# EAGLE design Hardware Schematic (EAGLE 9.6.2)
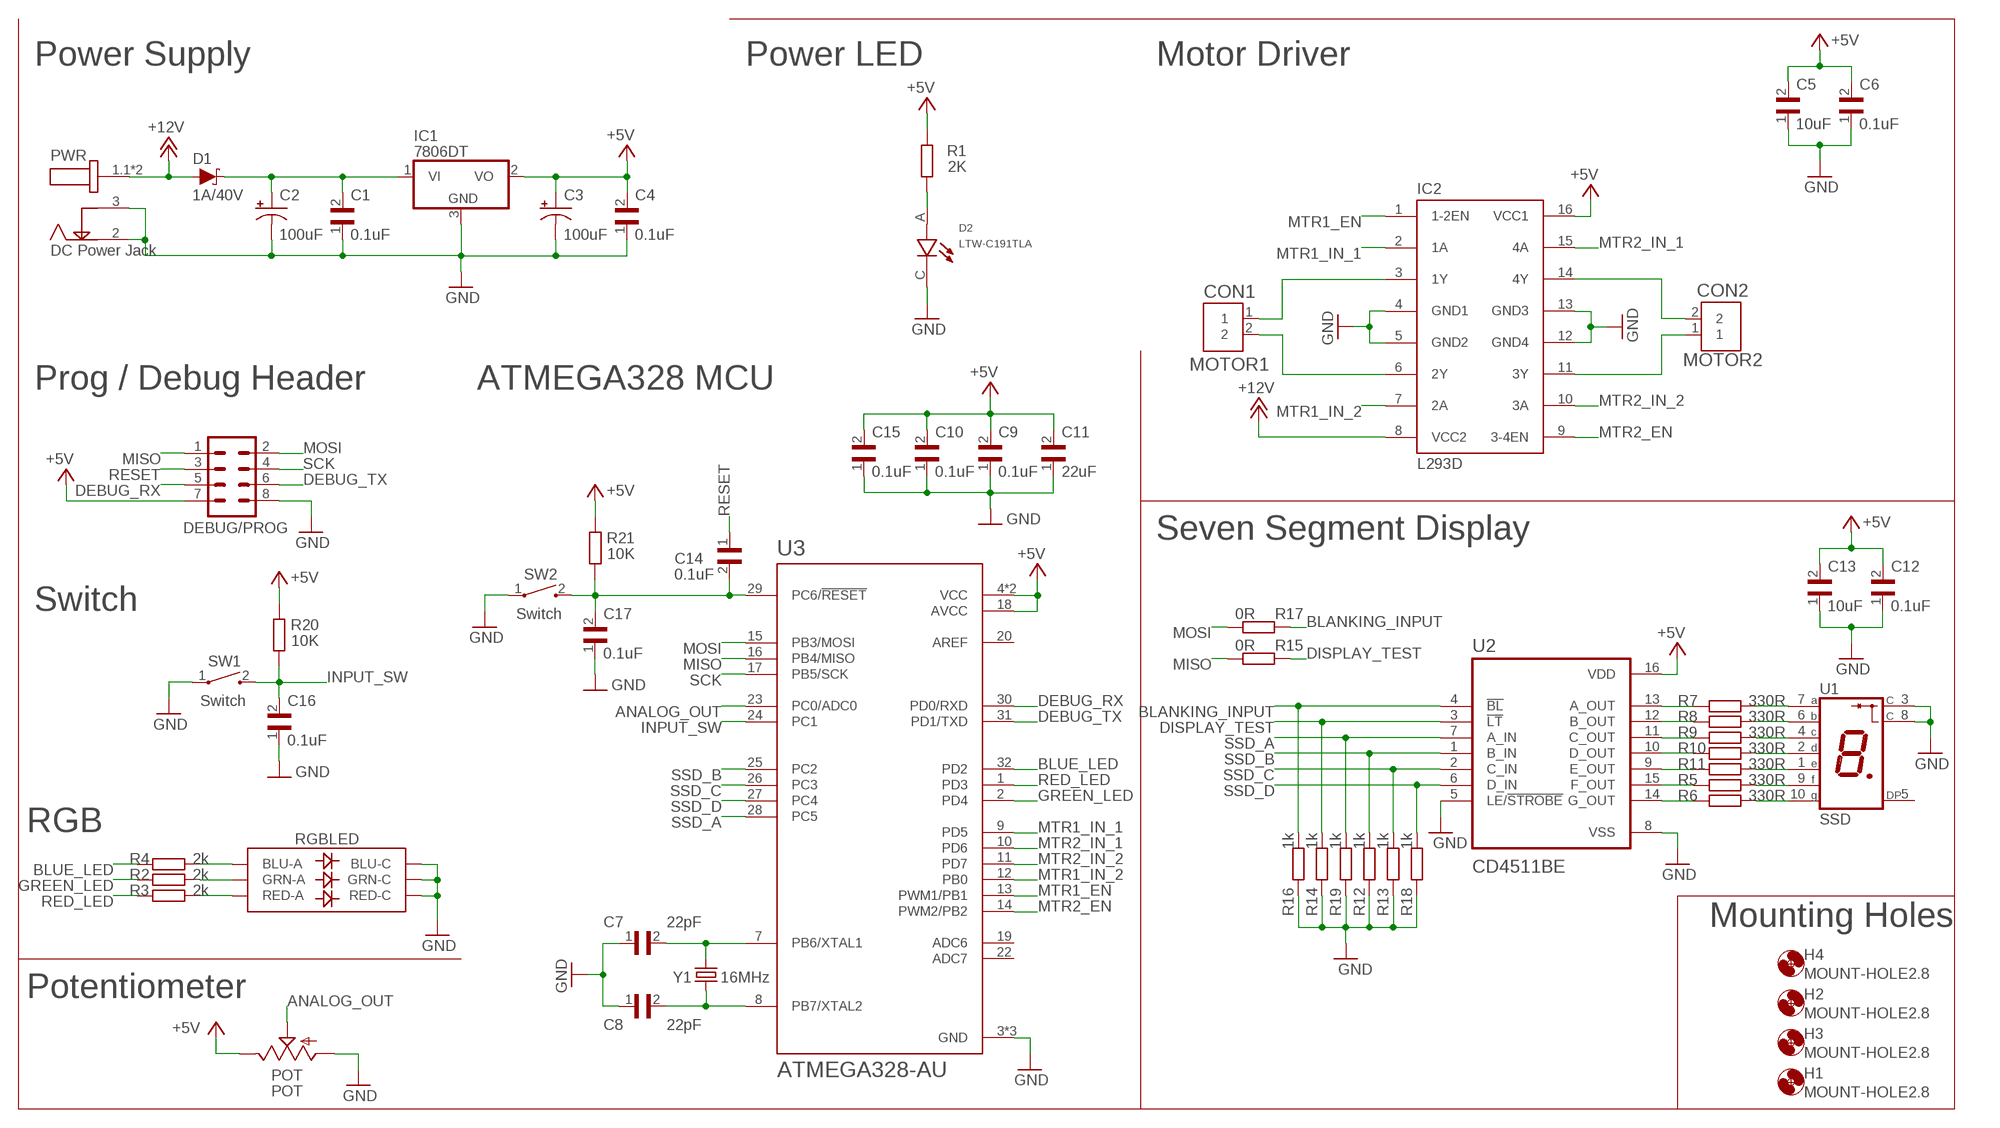
[diagram p0: schematic, sheet 1]

## Parts
C1  0.1uF  CAPACITOR  [C0603]
C2  100uF  100UF-POLAR-RADIAL-2.5MM-25V-20%  [CPOL-RADIAL-2.5MM-6.5MM]
C3  100uF  100UF-POLAR-RADIAL-2.5MM-25V-20%  [CPOL-RADIAL-2.5MM-6.5MM]
C4  0.1uF  CAPACITOR  [C0603]
C5  10uF  CAPACITOR  [C0603]
C6  0.1uF  CAPACITOR  [C0603]
C7  22pF  CAPACITOR  [C0603]
C8  22pF  CAPACITOR  [C0603]
C9  0.1uF  CAPACITOR  [C0603]
C10  0.1uF  CAPACITOR  [C0603]
C11  22uF  CAPACITOR  [C0603]
C12  0.1uF  CAPACITOR  [C0603]
C13  10uF  CAPACITOR  [C0603]
C14  0.1uF  CAPACITOR  [C0603]
C15  0.1uF  CAPACITOR  [C0603]
C16  0.1uF  CAPACITOR  [C0603]
C17  0.1uF  CAPACITOR  [C0603]
CON1  MOTOR1  282836-2  [CONN_282836-2]
CON2  MOTOR2  282836-2  [CONN_282836-2]
D1  1A/40V  DIODE-SCHOTTKY-SS14  [SMA-DIODE]
D2  LTW-C191TLA  [LEDC1608X65N]
DEBUG/PROG  MA04-2  [MA04-2]
H1  MOUNT-HOLE2.8  [2,8]
H2  MOUNT-HOLE2.8  [2,8]
H3  MOUNT-HOLE2.8  [2,8]
H4  MOUNT-HOLE2.8  [2,8]
IC1  7806DT  [TO252]
IC2  L293D  [DIL16]
POT  POT  TRIM_US-S64W  [S64W]
PWR  DC Power Jack  DCJ200-05-A-XX-X_REVA  [GCT_DCJ200-05-A-XX-X_REVA]
R1  2K  RESISTOR  [R0603]
R2  2k  RESISTOR  [R0603]
R3  2k  RESISTOR  [R0603]
R4  2k  RESISTOR  [R0603]
R5  330R  RESISTOR  [R0603]
R6  330R  RESISTOR  [R0603]
R7  330R  RESISTOR  [R0603]
R8  330R  RESISTOR  [R0603]
R9  330R  RESISTOR  [R0603]
R10  330R  RESISTOR  [R0603]
R11  330R  RESISTOR  [R0603]
R12  1k  RESISTOR  [R0603]
R13  1k  RESISTOR  [R0603]
R14  1k  RESISTOR  [R0603]
R15  0R  RESISTOR  [R0603]
R16  1k  RESISTOR  [R0603]
R17  0R  RESISTOR  [R0603]
R18  1k  RESISTOR  [R0603]
R19  1k  RESISTOR  [R0603]
R20  10K  RESISTOR  [R0603]
R21  10K  RESISTOR  [R0603]
RGBLED  LED-RGBNO_IC  [LED-TRICOLOR-5050]
SW1  Switch  1437566-3  [SW_1437566-3]
SW2  Switch  1437566-3  [SW_1437566-3]
U1  SSD  SC52-11HWA  [LED_SC52-11HWA]
U2  CD4511BE  [DIP794W45P254L1969H508Q16]
U3  ATMEGA328-AU  [QFP80P900X900X120-32N]
Y1  16MHz  CRYSTAL-16MHZPTH-HC49US  [HC49US]

## Nets
+5V: C3.1(+) C4.2 C5.2 C6.2 C9.2 C10.2 C11.2 C12.2 C13.2 C15.2 DEBUG/PROG.7 IC1.2(VO) IC2.16(VCC1) POT.E R1.2 R20.2 R21.2 U2.16(VDD) U3.4(VCC) U3.6(VCC) U3.18(AVCC)
+12V: D1.A IC2.8(VCC2) PWR.1.1 PWR.1.2
ANALOG_OUT: POT.S U3.23(PC0/ADC0)
BLANKING_INPUT: R16.2 R17.1 U2.4(!BL)
BLUE_LED: R4.1 U3.32(PD2)
DEBUG_RX: DEBUG/PROG.5 U3.30(PD0/RXD)
DEBUG_TX: DEBUG/PROG.6 U3.31(PD1/TXD)
DISPLAY_TEST: R14.2 R15.1 U2.3(!LT)
GND: C1.1 C2.2(-) C3.2(-) C4.1 C5.1 C6.1 C7.1 C8.1 C9.1 C10.1 C11.1 C12.1 C13.1 C15.1 C16.1 C17.1 D2.C DEBUG/PROG.8 IC1.3(GND) IC2.4(GND1) IC2.5(GND2) IC2.12(GND4) IC2.13(GND3) POT.A PWR.2 PWR.3 R12.1 R13.1 R14.1 R16.1 R18.1 R19.1 RGBLED.4(BLU-C) RGBLED.5(RED-C) RGBLED.6(GRN-C) SW1.1 SW2.1 U1.3(C) U1.8(C) U2.5(LE/!STROBE) U2.8(VSS) U3.3(GND) U3.5(GND) U3.21(GND)
GREEN_LED: R2.1 U3.2(PD4)
INPUT_SW: C16.2 R20.1 SW1.2 U3.24(PC1)
MISO: DEBUG/PROG.1 R15.2 U3.16(PB4/MISO)
MOSI: DEBUG/PROG.2 R17.2 U3.15(PB3/MOSI)
MTR1_EN: IC2.1(1-2EN) U3.13(PWM1/PB1)
MTR1_IN_1: IC2.2(1A) U3.9(PD5)
MTR1_IN_2: IC2.7(2A) U3.12(PB0)
MTR2_EN: IC2.9(3-4EN) U3.14(PWM2/PB2)
MTR2_IN_1: IC2.15(4A) U3.10(PD6)
MTR2_IN_2: IC2.10(3A) U3.11(PD7)
N$1: R3.2 RGBLED.2(RED-A)
N$2: R2.2 RGBLED.1(GRN-A)
N$3: R4.2 RGBLED.3(BLU-A)
N$4: R7.1 U2.13(A_OUT)
N$5: R8.1 U2.12(B_OUT)
N$6: R9.1 U2.11(C_OUT)
N$7: R10.1 U2.10(D_OUT)
N$8: R11.1 U2.9(E_OUT)
N$9: R5.1 U2.15(F_OUT)
N$10: R6.1 U2.14(G_OUT)
N$11: R7.2 U1.7(A)
N$12: R8.2 U1.6(B)
N$13: R9.2 U1.4(C)
N$14: R10.2 U1.2(D)
N$15: R11.2 U1.1(E)
N$16: R5.2 U1.9(F)
N$17: R6.2 U1.10(G)
N$18: CON2.1 IC2.11(3Y)
N$19: D2.A R1.1
N$20: C1.2 C2.1(+) D1.C IC1.1(VI)
N$21: C8.2 U3.8(PB7/XTAL2) Y1.1
N$22: C7.2 U3.7(PB6/XTAL1) Y1.2
N$24: C14.2 C17.2 R21.1 SW2.2 U3.29(PC6/!RESET)
N$34: CON1.1 IC2.3(1Y)
N$35: CON1.2 IC2.6(2Y)
N$36: CON2.2 IC2.14(4Y)
RED_LED: R3.1 U3.1(PD3)
RESET: C14.1 DEBUG/PROG.3
SCK: DEBUG/PROG.4 U3.17(PB5/SCK)
SSD_A: R19.2 U2.7(A_IN) U3.28(PC5)
SSD_B: R12.2 U2.1(B_IN) U3.25(PC2)
SSD_C: R13.2 U2.2(C_IN) U3.26(PC3)
SSD_D: R18.2 U2.6(D_IN) U3.27(PC4)
Unconnected: U1.5(DP) U3.19(ADC6) U3.20(AREF) U3.22(ADC7)

## Notes on the sheet
- Power Supply | Power LED | Motor Driver
- Prog / Debug Header | ATMEGA328 MCU
- Seven Segment Display
- Switch
- RGB
- Mounting Holes
- Potentiometer

## Library data of the parts
C1 C4-C17 = PC_Capacitor_0603:CAPACITOR: CAP CERAMIC, 0.1UF, 50V, X7R, 0603, FULL REEL Check prices <https://pricing.snapeda.com/parts/CGA3E2X7R1H104K080AA/TDK/view-part?ref=eda>; AVAILABILITY: Good; DESCRIPTION: 0.1µF ±10% 50V Ceramic Capacitor X7R 0603 (1608 Metric); MF: TDK; MP: CGA3E2X7R1H104K080AA; PACKAGE: 1608 TDK; PRICE: None; PURCHASE-URL: https://pricing.snapeda.com/search/part/CGA3E2X7R1H104K080AA/?ref=eda
C2 C3 = SparkFun-Capacitors:100UF-POLAR: 100µF polarized capacitors A capacitor is a passive two-terminal electrical component used to store electrical energy temporarily in an electric field.; PROD_ID: CAP-08439
CON1 CON2 = PC_Con_ScrewTerminal_2P_5mm:282836-2: TERM BLOCK 2POS SIDE ENTRY 5MM Check availability <https://pricing.snapeda.com/parts/282836-2/TE%20Connectivity/view-part?ref=eda>; AVAILABILITY: In Stock; COMMENT: 282836-2; DESCRIPTION: Connector, Terminal Block; Wire Receptacle; 2 Pos.; 16-30 AWG; 0.197 in. CL; Sid; MF: TE Connectivity; MP: 282836-2; PACKAGE: None; PRICE: None; PURCHASE-URL: https://pricing.snapeda.com/search/part/282836-2/?ref=eda
D1 = SparkFun-DiscreteSemi:DIODE-SCHOTTKY: Schottky diode A Schottky diode is a semiconductor diode which has a low forward voltage drop and a very fast switching action.; PROD_ID: DIO-08053; VALUE: 1A/40V/500mV
D2 = PC_LED_0603:LTW-C191TLA: CHIP LED WHITE 0603 TOP VIEW Check prices <https://pricing.snapeda.com/parts/LTW-C191TLA/Lite-On/view-part?ref=eda>; AVAILABILITY: Warning; DESCRIPTION: White LED Indication - Discrete 3.1V 0603 (1608 Metric); MF: Lite-On; MP: LTW-C191TLA; PACKAGE: 0603 Lite-On; PRICE: None; PURCHASE-URL: https://pricing.snapeda.com/search/part/LTW-C191TLA/?ref=eda
DEBUG/PROG = con-lstb:MA04-2: PIN HEADER; OC_FARNELL: unknown; OC_NEWARK: unknown
H1-H4 = holes:MOUNT-HOLE: MOUNTING HOLE with drill center marker
IC1 = linear:78*: Positive VOLTAGE REGULATOR Source: http://cache.national.com/ds/LM/LM78L05.pdf http://www.fairchildsemi.com/ds/LM/LM7805.pdf
IC2 = st-microelectronics:L293D: PUSH-PULL 4 CHANNEL DRIVER; MPN: L293D; OC_FARNELL: 9589619; OC_NEWARK: 56P8249
POT = pot:TRIM_US-: POTENTIOMETER
PWR = PC_CON_DC_Power_Jack:DCJ200-05-A-XX-X_REVA: DC Power Jack, SMT, Horizontal, with Locating Pegs, D2.0mm Check prices <https://pricing.snapeda.com/parts/DCJ200-05-A-K1-A/Global%20Connector%20Technology/view-part?ref=eda>; AVAILABILITY: Warning; DESCRIPTION: Power Barrel Connector Jack 2.05mm ID (0.081), 5.50mm OD (0.217) Surface Mount, Right Angle; MF: Global Connector Technology; MP: DCJ200-05-A-K1-A; PACKAGE: None; PRICE: None; PURCHASE-URL: https://pricing.snapeda.com/search/part/DCJ200-05-A-K1-A/?ref=eda
R1-R21 = PC_Resistor_0603:RESISTOR; MF: Yageo; RESISTOR: 0603
RGBLED = SparkFun-LED:LED-RGB: LED-RGB 6 pin RGB LED (no common connector) Packages: PLCC-6 LED-TRICOLOR-5050 - No built-in IC SparkFun Products: Digital Sandbox <https://www.sparkfun.com/products/12651> LED- SMD RGB <https://www.sparkfun.com/products/10866>; PROD_ID: DIO-10298
SW1 SW2 = PC_Switch_1437566-3:1437566-3: Switch Tactile OFF (ON) SPST Rectangular Button Gull Wing 0.05A 12VDC SMD Loose Piece Check prices <https://pricing.snapeda.com/parts/1437566-3/TE%20Connectivity/view-part?ref=eda>; AVAILABILITY: Good; COMMENT: 1437566-3; CONFIGURATION_POLE-THROW: Single Pole - Single Throw; CONTACT_CURRENT_RATING: 50 mA; DESCRIPTION: Tactile Switch SPST-NO Top Actuated Surface Mount; MF: TE Connectivity; MP: 1437566-3; PACKAGE: None; PRICE: None
U1 = PC_LED-7-SegmentDisplay:SC52-11HWA: Display: LED; single 7-segment; 13.2mm; red; 0.9-2.2mcd Check availability <https://pricing.snapeda.com/parts/SC52-11HWA/Kingbright/view-part?ref=eda>; AVAILABILITY: Not in stock; DESCRIPTION: Display: LED; single 7-segment; 13.2mm; red; 0.9-2.2mcd; MF: Kingbright; MP: SC52-11HWA; PACKAGE: None; PRICE: None
U2 = PC_IC_CD4511BE:CD4511BE: None Check availability <https://pricing.snapeda.com/parts/CD4511BE/Texas%20Instruments/view-part?ref=eda>; AVAILABILITY: In Stock; DESCRIPTION: CMOS BCD-to-7-Segment LED Latch Decoder Drivers 16-PDIP -55 to 125; MF: Texas Instruments; MP: CD4511BE; PACKAGE: PDIP-16 Texas Instruments; PRICE: None; PURCHASE-URL: https://pricing.snapeda.com/search/part/CD4511BE/?ref=eda
U3 = PC_IC_ATMEGA328-AU:ATMEGA328-AU: ATmega Series 20 MHz 32 KB Flash 2 KB SRAM 8-Bit Microcontroller - TQFP-32 Check prices <https://pricing.snapeda.com/parts/ATMEGA328-AU/Microchip/view-part?ref=eda>; AVAILABILITY: In Stock; DESCRIPTION: AVR AVR® ATmega Microcontroller IC 8-Bit 20MHz 32KB (16K x 16) FLASH 32-TQFP (7x7); MF: Microchip; MP: ATMEGA328-AU; PACKAGE: TQFP-32 Microchip; PRICE: None; PURCHASE-URL: https://pricing.snapeda.com/search/part/ATMEGA328-AU/?ref=eda
Y1 = SparkFun-Clocks:CRYSTAL-16MHZ: 16MHz Crystal Digikey Example <http://www.digikey.com/product-search/en?keywords=535-9122-1-ND> Frequency: 16MHz Frequency Stability: ±50ppm Frequency Tolerance: ±20ppm Load Capacitance: 18pF SparkFun Products: Pro Micro -5V/16MHz <https://www.sparkfun.com/products/12640> SparkFun Serial Enabled LCD Kit <https://www.sparkfun.com/products/10097>; PROD_ID: XTAL-08181; SF_ID: COM-00536

## Board
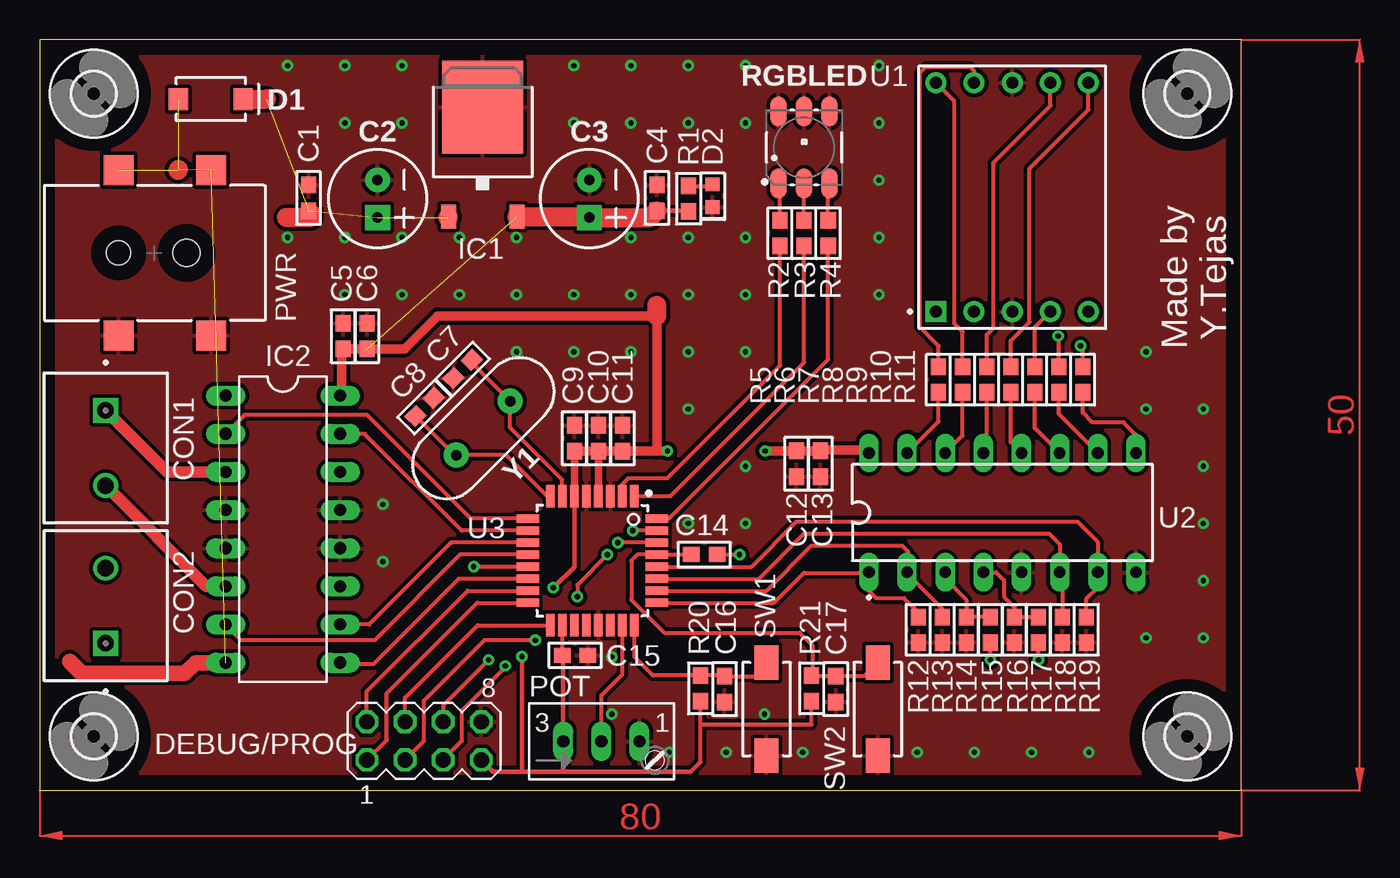
[diagram p1: board, top side]
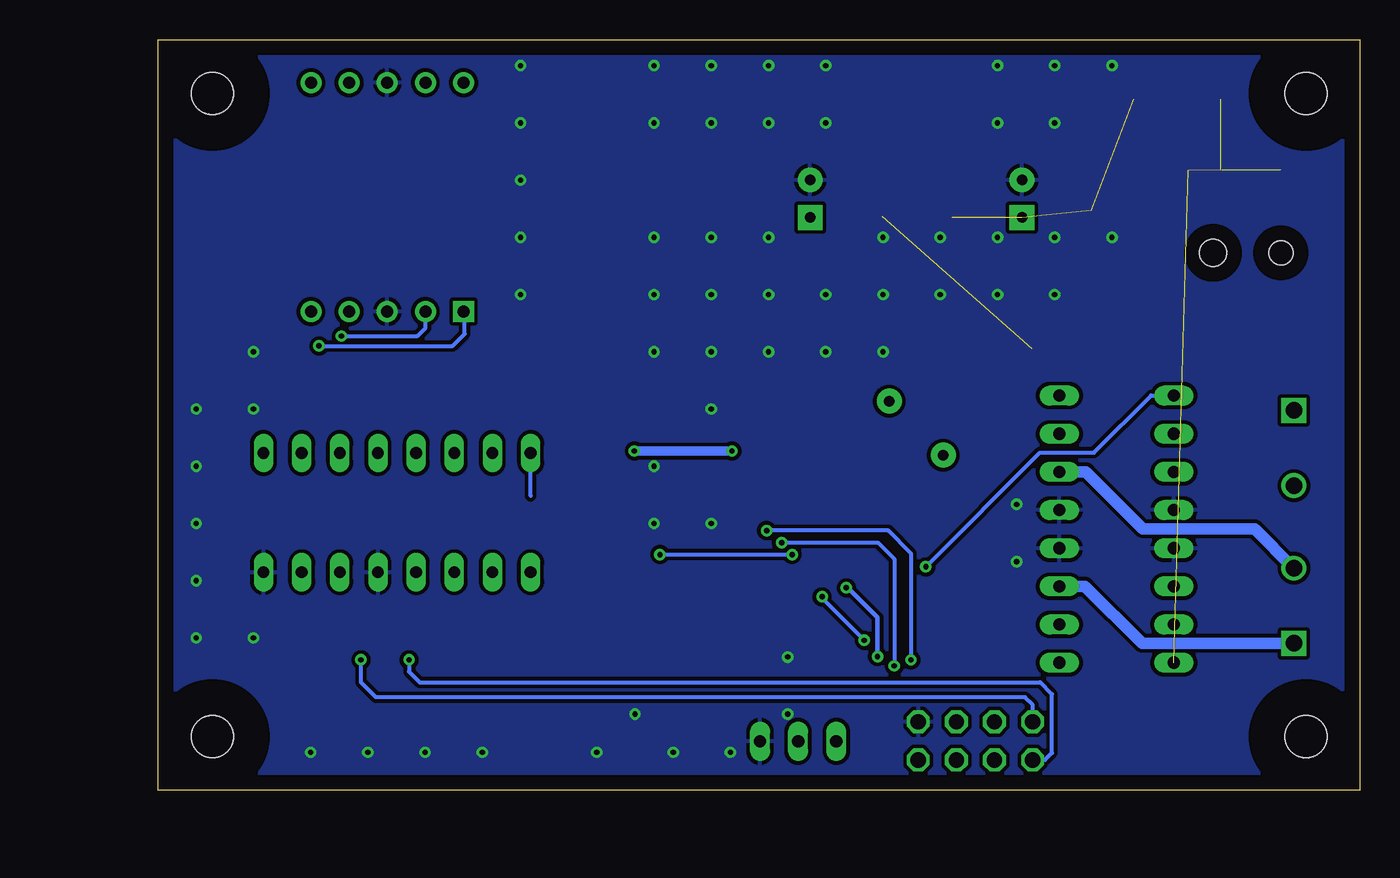
[diagram p2: board, bottom side, seen from below]

Size 80 x 50 mm. Coordinates in mm from the lower left corner, seen from the top.
Outline: 0,0 80,0 80,50 0,50 0,0
Copper layers (1*16): Top 0.035mm / dielectric 1.5mm / Bottom 0.035mm
Design rules "default *": minimum track width 6mil, minimum drill 0.35mm, track to track 6mil, track to pad 6mil, pad to pad 6mil, via to via 6mil, smd to smd 6mil, copper to edge 40mil, drill to drill 6mil, minimum pad ring 10mil, minimum via ring 8mil, stop-mask expansion 4mil, vias tented up to drill 20mil, thermal gap 10mil

### Footprints (pad centres in the part's own frame; a part is rotated, then mirrored left to right if it is on the bottom)
C0603 = smd 1.1 x 1: 1 -0.909,0; 2 0.809,0
CPOL-RADIAL-2.5MM-6.5MM = drill 0.7 pad 1.651 square: 1 1.25,0 | drill 0.7 pad 1.651: 2 -1.25,0
CONN_282836-2 = drill 1.1 square: 1 -2.5,0 | drill 1.1: 2 2.5,0
SMA-DIODE = smd 1.27 x 1.47: A -2.15,0; C 2.15,0
LEDC1608X65N = smd 0.91 x 0.93: A 0.76,0; C -0.76,0
MA04-2 = drill 1.016 octagon: 1 -3.81,-1.27; 2 -3.81,1.27; 3 -1.27,-1.27; 4 -1.27,1.27; 5 1.27,-1.27; 6 1.27,1.27; 7 3.81,-1.27; 8 3.81,1.27
2,8 = hole 2.8: 0,0
TO252 = smd 1 x 1.6: 1 -2.28,-4.8; 2 2.28,-4.8 | smd 5.4 x 6.2: 3 0,2.5
DIL16 = drill 0.813 long: 1 -8.89,-3.81; 2 -6.35,-3.81; 3 -3.81,-3.81; 4 -1.27,-3.81; 5 1.27,-3.81; 6 3.81,-3.81; 7 6.35,-3.81; 8 8.89,-3.81; 9 8.89,3.81; 10 6.35,3.81; 11 3.81,3.81; 12 1.27,3.81; 13 -1.27,3.81; 14 -3.81,3.81; 15 -6.35,3.81; 16 -8.89,3.81
S64W = drill 0.813 long: A 2.54,1.27; E -2.54,1.27; S 0,1.27
GCT_DCJ200-05-A-XX-X_REVA = smd 2 x 2: 1.1 -5.5,3.8; 1.2 -5.5,-2.35; 2 5.5,-2.35; 3 5.5,3.8 | hole 1.8: 0,2.15 | hole 1.6: 0,-2.35
R0603 = smd 1.1 x 1: 1 -0.85,0; 2 0.85,0
LED-TRICOLOR-5050 = smd 2 x 1.1: 1 -2.4,1.7; 2 -2.4,0; 3 -2.4,-1.7; 4 2.4,-1.7; 5 2.4,0; 6 2.4,1.7
SW_1437566-3 = smd 2.3 x 1.6: 1 -3.08,0; 2 3.12,0
LED_SC52-11HWA = drill 0.8 pad 1.4 square: 1 -7.62,5.08 | drill 0.8 pad 1.4: 2 -7.62,2.54; 3 -7.62,0; 4 -7.62,-2.54; 5 -7.62,-5.08; 6 7.62,-5.08; 7 7.62,-2.54; 8 7.62,0; 9 7.62,2.54; 10 7.62,5.08
DIP794W45P254L1969H508Q16 = drill 0.78 pad 1.13 long: 1 -3.97,8.89; 2 -3.97,6.35; 3 -3.97,3.81; 4 -3.97,1.27; 5 -3.97,-1.27; 6 -3.97,-3.81; 7 -3.97,-6.35; 8 -3.97,-8.89; 9 3.97,-8.89; 10 3.97,-6.35; 11 3.97,-3.81; 12 3.97,-1.27; 13 3.97,1.27; 14 3.97,3.81; 15 3.97,6.35; 16 3.97,8.89
QFP80P900X900X120-32N = smd 1.5 x 0.55: 1 -4.3,2.8; 2 -4.3,2; 3 -4.3,1.2; 4 -4.3,0.4; 5 -4.3,-0.4; 6 -4.3,-1.2; 7 -4.3,-2; 8 -4.3,-2.8; 17 4.3,-2.8; 18 4.3,-2; 19 4.3,-1.2; 20 4.3,-0.4; 21 4.3,0.4; 22 4.3,1.2; 23 4.3,2; 24 4.3,2.8 | smd 0.55 x 1.5: 9 -2.8,-4.3; 10 -2,-4.3; 11 -1.2,-4.3; 12 -0.4,-4.3; 13 0.4,-4.3; 14 1.2,-4.3; 15 2,-4.3; 16 2.8,-4.3; 25 2.8,4.3; 26 2,4.3; 27 1.2,4.3; 28 0.4,4.3; 29 -0.4,4.3; 30 -1.2,4.3; 31 -2,4.3; 32 -2.8,4.3
HC49US = drill 0.7 pad 1.651: 1 -2.54,0; 2 2.54,0

### Placement (x,y rotation side)
C1  17.9,39.4 270 top
C2  22.5,39.4 270 top
C3  36.6,39.4 270 top
C4  41.1,39.4 270 top
C5  20.2,30.2 270 top
C6  21.8,30.2 270 top
C7  28.2,28.1 45 top
C8  25.6,25.5 225 top
C9  35.6,23.4 270 top
C10  37.2,23.4 270 top
C11  38.8,23.4 270 top
C12  50.4,21.8 90 top
C13  52,21.8 90 top
C14  44.2,15.7 180 top
C15  35.6,9 180 top
C16  45.6,6.8 90 top
C17  53,6.8 90 top
CON1  4.4,22.8 270 top
CON2  4.4,12.3 90 top
D1  11.4,46.03 0 top
D2  44.8,39.6 90 top
DEBUG/PROG  25.6,3.3 0 top
H1  3.6,46.4 0 top
H2  76.4,46.4 0 top
H3  3.6,3.6 0 top
H4  76.4,3.6 0 top
IC1  29.5,43 0 top
IC2  16.2,17.4 270 top
POT  37.4,2 0 top
PWR  7.62,35.79 270 top
R1  43.2,39.4 270 top
R2  49.3,37.1 90 top
R3  50.9,37.1 90 top
R4  52.5,37.1 90 top
R5  59.85,27.35 90 top
R6  61.45,27.35 90 top
R7  63.05,27.35 90 top
R8  64.65,27.35 90 top
R9  66.25,27.35 90 top
R10  67.85,27.35 90 top
R11  69.45,27.35 90 top
R12  58.5,10.7 90 top
R13  60.1,10.7 90 top
R14  61.7,10.7 90 top
R15  63.3,10.7 270 top
R16  64.9,10.7 90 top
R17  66.5,10.7 270 top
R18  68.1,10.7 90 top
R19  69.7,10.7 90 top
R20  44,6.8 270 top
R21  51.4,6.8 270 top
RGBLED  50.9,42.81 90 top
SW1  48.4,5.4 90 top
SW2  55.8,5.4 90 top
U1  64.75,39.5 90 top
U2  64.1,18.5 90 top
U3  36.8,15.3 270 top
Y1  29.53,24.13 45 top

### Tracks (layer width: path | path; a pad name or v marks a point on that pad's centre or on a via)
+5V  (via drill 0.35)  (1 unrouted)
  Top 0.254: 37.2,22.5 C10.2 | C13.2 52.06,22.67 | U2.16 55.01,22.67 | 20.11,29.3 C5.2 | U3.18 C15.2 | 43.34,1.24 44,1.9 44,4.4 | 44,4.4 R20.2 | 44,4.4 51.4,4.4 R21.2 | 32.12,1.26 32.1,1.24
  Top 0.305: U3.6 35.6,14.9 v34.2,13.5 | 43.34,1.24 34.86,1.24 | 34.86,1.24 34.86,1.25 POT.E 34.86,8.93 C15.2 | 34.86,1.24 32.1,1.24 30.2,1.24 DEBUG/PROG.7 | C4.2 43.16,38.59 R1.2 | v32.12,8.92 32.12,1.26
  Top 0.508: C9.2 U3.6 | U3.4 37.2,22.5
  Top 0.635: 55.01,22.67 52.06,22.67 | C13.2 C12.2 v48.31,22.61 v48.3,22.6 | 20.11,29.3 20.11,26.39 IC2.16 | C5.2 C6.2 24.29,29.39 26.5,31.6 41.1,31.6 | 41.1,32.3 41.1,22.6 41.09,22.59 | 41.09,22.59 C11.2 37.29,22.59 | 37.29,22.59 37.2,22.5 | C9.2 37.29,22.59 | v41.8,22.6 v41.79,22.59 41.09,22.59
  Top 1.27: IC1.2 36.55,38.2 C3.1 40.66,38.15 C4.2 | 41.1,31.6 41.1,32.3
  Bottom 0.254: 55.21,19.61 U2.16
  Bottom 0.305: v34.2,13.5 34.1,13.5 32.12,11.52 v32.12,8.92
  Bottom 0.635: v48.3,22.6 v41.8,22.6
+12V  (4 unrouted)
  Top 1.016: 2,8.6 2.8,7.8 9.68,7.8 10.39,8.51 IC2.8
  Top 1.27: 9.25,41.34 9.2,41.29
ANALOG_OUT
  Top 0.254: POT.S 37.4,6.33 38.8,7.73 U3.23
BLANKING_INPUT
  Top 0.254: U2.4 63.67,14.53 64.2,14 64.2,12.9 64.9,12.2 R16.2 R17.1
BLUE_LED
  Top 0.254: U3.32 41.9,18.1 52.5,28.7 R4.1
DEBUG_RX  (via drill 0.35)
  Top 0.254: U3.30 v38.5,16.5 | DEBUG/PROG.5 26.87,2.07 28.1,3.3 28.1,5.3 31,8.2 v31,8.3
  Bottom 0.254: v38.5,16.5 32.1,16.5 31,15.4 v31,8.3
DEBUG_TX  (via drill 0.35)
  Top 0.254: U3.31 v39.5,17.3 | v29.89,8.69 26.87,5.67 DEBUG/PROG.6
  Bottom 0.254: v39.5,17.3 31.4,17.3 29.89,15.79 v29.89,8.69
DISPLAY_TEST
  Top 0.254: U2.3 60.29,14.11 61.7,12.7 R14.2 R15.1
GND  (via drill 0.35)
  other vias: 77.47,25.4 73.66,25.4 77.47,21.59 77.47,17.78 77.47,13.97 77.47,10.16 55.88,40.64 55.88,36.83 55.88,33.02 46.99,33.02 46.99,29.21 39.37,33.02 35.56,33.02 31.75,33.02 27.94,33.02 24.13,33.02 46.99,48.26 46.99,44.45 43.18,48.26 43.18,44.45 39.37,48.26 39.37,44.45 35.56,48.26 35.56,44.45 24.13,48.26 20.32,48.26 16.51,48.26 20.32,44.45 24.13,44.45 43.18,33.02 43.18,29.21 43.18,25.4 43.18,17.78 46.99,17.78 22.86,19.05 22.86,15.24 39.37,29.21 35.56,29.21 31.75,29.21 55.88,44.45 46.99,36.83 43.18,36.83 20.32,33.02 20.32,36.83 16.51,36.83 27.94,36.83 31.75,36.83 39.37,36.83 55.88,48.26 24.13,36.83 46.99,21.59 73.66,10.16 69.85,2.54 66.04,2.54 62.23,2.54 58.42,2.54 50.8,2.54 45.72,2.54 48.26,5.08 73.66,29.21 41.91,2.54 38.1,5.08 38.1,8.89
  pour Top (isolate 0.254): -1.27,52.07 6.35,52.07 82.55,52.07 82.55,45.72 82.55,-2.54 67.31,-2.54 -2.54,-2.54 -2.54,52.07
  pour Bottom (isolate 0.254): -2.54,52.07 0,52.07 82.55,52.07 82.55,45.72 82.55,-2.54 76.2,-2.54 -2.54,-2.54
GREEN_LED
  Top 0.254: U3.2 38.8,20.4 39.2,20.8 41.8,20.8 49.3,28.3 R2.1
INPUT_SW
  Top 0.254: U3.24 39.6,8.9 40.85,7.65 R20.1 45.56,7.65 C16.2 48.4,7.61 SW1.2
MISO  (via drill 0.35)
  Top 0.254: DEBUG/PROG.1 23.11,3.35 23.11,6.48 29.14,12.5 U3.16 | v63.3,8.7 R15.2
  Bottom 0.254: DEBUG/PROG.1 20.97,2.03 20.5,2.5 20.5,6.4 21.29,7.18 | 21.29,7.18 21.3,7.2 | v63.3,8.7 63.3,7.9 62.59,7.18 21.29,7.18
MOSI  (via drill 0.35)
  Top 0.254: DEBUG/PROG.2 21.79,6.6 28.49,13.3 U3.15 | v66.5,8.7 R17.2
  Bottom 0.254: DEBUG/PROG.2 21.79,5.69 22.3,6.2 65.5,6.2 66.5,7.2 v66.5,8.7
MTR1_EN  (via drill 0.35)
  Top 0.254: U3.13 v28.9,14.9
  Bottom 0.254: IC2.1 13.9,26.3 17.7,22.5 21.3,22.5 v28.9,14.9
MTR1_IN_1
  Top 0.254: U3.9 28.7,18.1 21.8,25 13.64,25 IC2.2
MTR1_IN_2
  Top 0.254: U3.12 28,15.7 22.3,10 13.44,10 IC2.7
MTR2_EN
  Top 0.254: U3.14 27.9,14.1 22.2,8.4 20.12,8.4 IC2.9
MTR2_IN_1
  Top 0.254: IC2.15 21.65,23.75 28.1,17.3 U3.10
MTR2_IN_2
  Top 0.254: IC2.10 21.95,11.05 27.4,16.5 U3.11
N$1
  Top 0.254: R3.2 RGBLED.2
N$2
  Top 0.254: R2.2 49.3,40.31 RGBLED.1
N$3
  Top 0.254: R4.2 52.5,40.31 RGBLED.3
N$4
  Top 0.254: U2.13 63.05,22.69 R7.1
N$5
  Top 0.254: U2.12 64.65,23.19 R8.1
N$6
  Top 0.254: U2.11 66.25,24.13 R9.1
N$7
  Top 0.254: U2.10 67.85,25.07 R10.1
N$8
  Top 0.254: U2.9 72.99,23.67 72.16,24.5 70.1,24.5 69.45,25.15 R11.1
N$9
  Top 0.254: U2.15 59.85,24.57 R5.1
N$10
  Top 0.254: U2.14 61.45,23.63 R6.1
N$11
  Top 0.254: R7.2 63.05,30.35 63.5,30.8 63.5,41.8 67.3,45.6 U1.7
N$12
  Top 0.254: R8.2 64.65,29.95 65.9,31.2 65.9,41.4 69.83,45.33 U1.6
N$13
  Top 0.254: R9.2 66.25,30.84 U1.4
N$14  (via drill 0.35)
  Top 0.254: R10.2 67.85,30.15 67.8,30.2 v67.8,30.26
  Bottom 0.254: v67.8,30.26 62.74,30.26 62.2,30.8 U1.2
N$15  (via drill 0.35)
  Top 0.254: R11.2 69.45,29.45 v69.3,29.6
  Bottom 0.254: v69.3,29.6 60.4,29.6 59.6,30.4 59.6,31.81 U1.1
N$16
  Top 0.254: R5.2 59.85,29.6 58.6,30.85 58.6,47.8 59,48.2 61.93,48.2 62.21,47.92 U1.9
N$17
  Top 0.254: R6.2 61.45,30.55 60.9,31.1 60.9,45.89 U1.10
N$18
  Bottom 0.762: CON2.1 14.5,9.8 18.3,13.6 IC2.11
N$19
  Top 0.254: R1.1 44.93,40.25 D2.A
N$20  (3 unrouted)
  Top 0.254: C1.2 18.03,38.46
  Top 1.27: D1.C 15.1,46.03 | 27.17,38.15 IC1.1 | 16.45,38.15 18.03,38.15 18.03,38.46
N$21
  Top 0.254: U3.8 33.8,19.6 31.07,22.33 Y1.1 27.62,22.33 C8.2
N$22
  Top 0.254: U3.7 34.8,20.7 31.33,24.17 Y1.2 28.77,28.48 C7.2
N$24
  Top 0.254: SW2.2 54.89,7.61 C17.2 51.44,7.61 | 51.44,7.61 R21.1 | C14.2 U3.29 39.8,15.7 39.4,15.3 39.4,12.7 41.6,10.5 50.6,10.5 51.44,9.66 51.44,7.61
N$34
  Top 0.762: IC2.3 8.49,21.21 CON1.1
N$35
  Top 0.762: IC2.6 11.11,13.59 CON1.2
N$36
  Bottom 0.762: IC2.14 18.24,21.21 14.45,17.42 7.02,17.42 CON2.2
RED_LED
  Top 0.254: U3.1 42,19.6 50.9,28.5 R3.1
RESET  (via drill 0.35)
  Top 0.254: v33,10 29.6,10 25.6,6 25.6,3.3 DEBUG/PROG.3 | C14.1 v46.6,15.7 | v37.8,15.7 35.8,13.7 v35.8,12.9
  Bottom 0.254: v35.8,12.9 35.85,12.85 v33,10 | v46.6,15.7 v37.8,15.7
SCK
  Top 0.254: DEBUG/PROG.4 24.33,6.17 29.16,11 U3.17
SSD_A
  Top 0.254: U3.28 47.4,14.9 50.4,17.9 69.1,17.9 70.45,16.55 U2.7 70.45,13.53 69.7,12.78 R19.2
SSD_B
  Top 0.254: R12.2 58.5,11.85 57.55,12.8 55.7,12.8 55.21,13.29 55.21,14.5 | 55.21,14.5 U2.1 | U3.25 48.9,12.5 50.9,14.5 55.21,14.5
SSD_C
  Top 0.254: R13.2 60.1,12.1 57.75,14.45 U2.2 57.8,14.58 57.8,15.9 57.4,16.3 51.4,16.3 48.4,13.3 U3.26
SSD_D
  Top 0.254: U2.6 | U2.6 68.1,14.34 R18.2 | U3.27 47.9,14.1 50.9,17.1 67.2,17.1 67.92,16.38 U2.6
(copper drawn outside any net)
  shapes: Top area x2

### Text on the board
tPlace: Tejas | Y. | Made by